# Altium schematic sheet differentialAmp.SchDoc
size A4
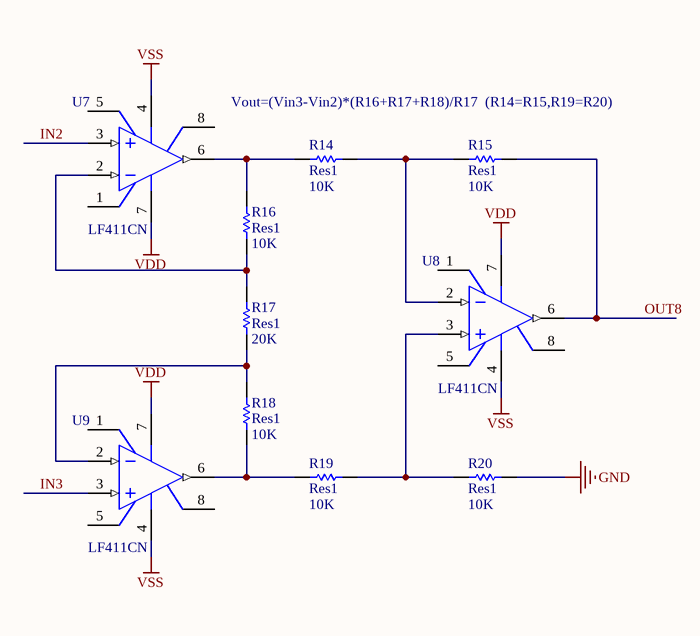
[diagram p0: differentialAmp.SchDoc]

## Parts
R14  Res1  value 10K  [AXIAL-0.3]
R15  Res1  value 10K  [AXIAL-0.3]
R16  Res1  value 10K  [AXIAL-0.3]
R17  Res1  value 20K  [AXIAL-0.3]
R18  Res1  value 10K  [AXIAL-0.3]
R19  Res1  value 10K  [AXIAL-0.3]
R20  Res1  value 10K  [AXIAL-0.3]
U7  LF411CN  [N08E]
U8  LF411CN  [N08E]
U9  LF411CN  [N08E]

## Nets
GND: R20.2
VDD: U7.7(V+) U8.7(V+) U9.7(V+)
VSS: U7.4(V-) U8.4(V-) U9.4(V-)
IN2: U7.3(IN+)
IN3: U9.3(IN+)
OUT8: R15.2 U8.6(OUT)
NetR14_1: R14.1 R16.1 U7.6(OUT)
NetR14_2: R14.2 R15.1 U8.2(IN-)
NetR16_2: R16.2 R17.1 U7.2(IN-)
NetR17_2: R17.2 R18.1 U9.2(IN-)
NetR18_2: R18.2 R19.1 U9.6(OUT)
NetR19_2: R19.2 R20.1 U8.3(IN+)

Not connected (* = marked no-connect by the designer): U7 1(BAL) 5(BAL) 8(NC); U8 1(BAL) 5(BAL) 8(NC); U9 1(BAL) 5(BAL) 8(NC)

## Notes on the sheet
- Vout=(Vin3-Vin2)*(R16+R17+R18)/R17  (R14=R15,R19=R20)

## Library data of the parts
R14-R20 = Res1: Resistor; Published: 8-Jun-2000; LatestRevisionDate: 17-Jul-2002; LatestRevisionNote: Re-released for DXP Platform.; PackageReference: AXIAL-0.3; Publisher: Altium Limited; PackageDescription: Axial Device, Thru-Hole; 2 Leads; 0.3 in Pin Spacing
U7-U9 = LF411CN: Low Offset, Low Drift JFET Input Operational Amplifier, 8-pin MDIP; Manufacturer: National Semiconductor; PackageTopMarking: NSUZXYTTE#*LF*411CN; PowerWise: N; CompType: Amplifiers; Published: 4-Dec-2008; LatestRevisionDate: 13-Jan-2009; LatestRevisionNote: Sim Model Added.; DatasheetVersion: Aug-2000; PackageVersion: revG, May-2006; PackageReference: N08E; Publisher: Altium Limited; PackageDescription: MDIP, .365 x .250 x .130in, 8 Lead, .100in Pitch; Supplier 1: Farnell; Supplier Part Number 1: 9487026; PartNumber: LF411CN; RoHS: N; PinCount: 8; Code_JEDEC: MS-001-BA; ComponentLink1Description: LF411 Datasheet; ComponentLink1URL: http://www.national.com/ds/LF/LF411.pdf; ComponentLink2Description: LF411 Web Page; ComponentLink2URL: http://www.national.com/pf/LF/LF411.html; ComponentLink3Description: N08E Package Page; ComponentLink3URL: http://www.national.com/packaging/folders/n08e.html